# Altium schematic sheet PCIE.SchDoc: PCIE
size A3; Author: Silvio Navaretti; CompanyName: ARDUINO; Organization: ARDUINO; SheetNumber: 24; SheetTotal: 51; RevAuthor: Silvio Navaretti
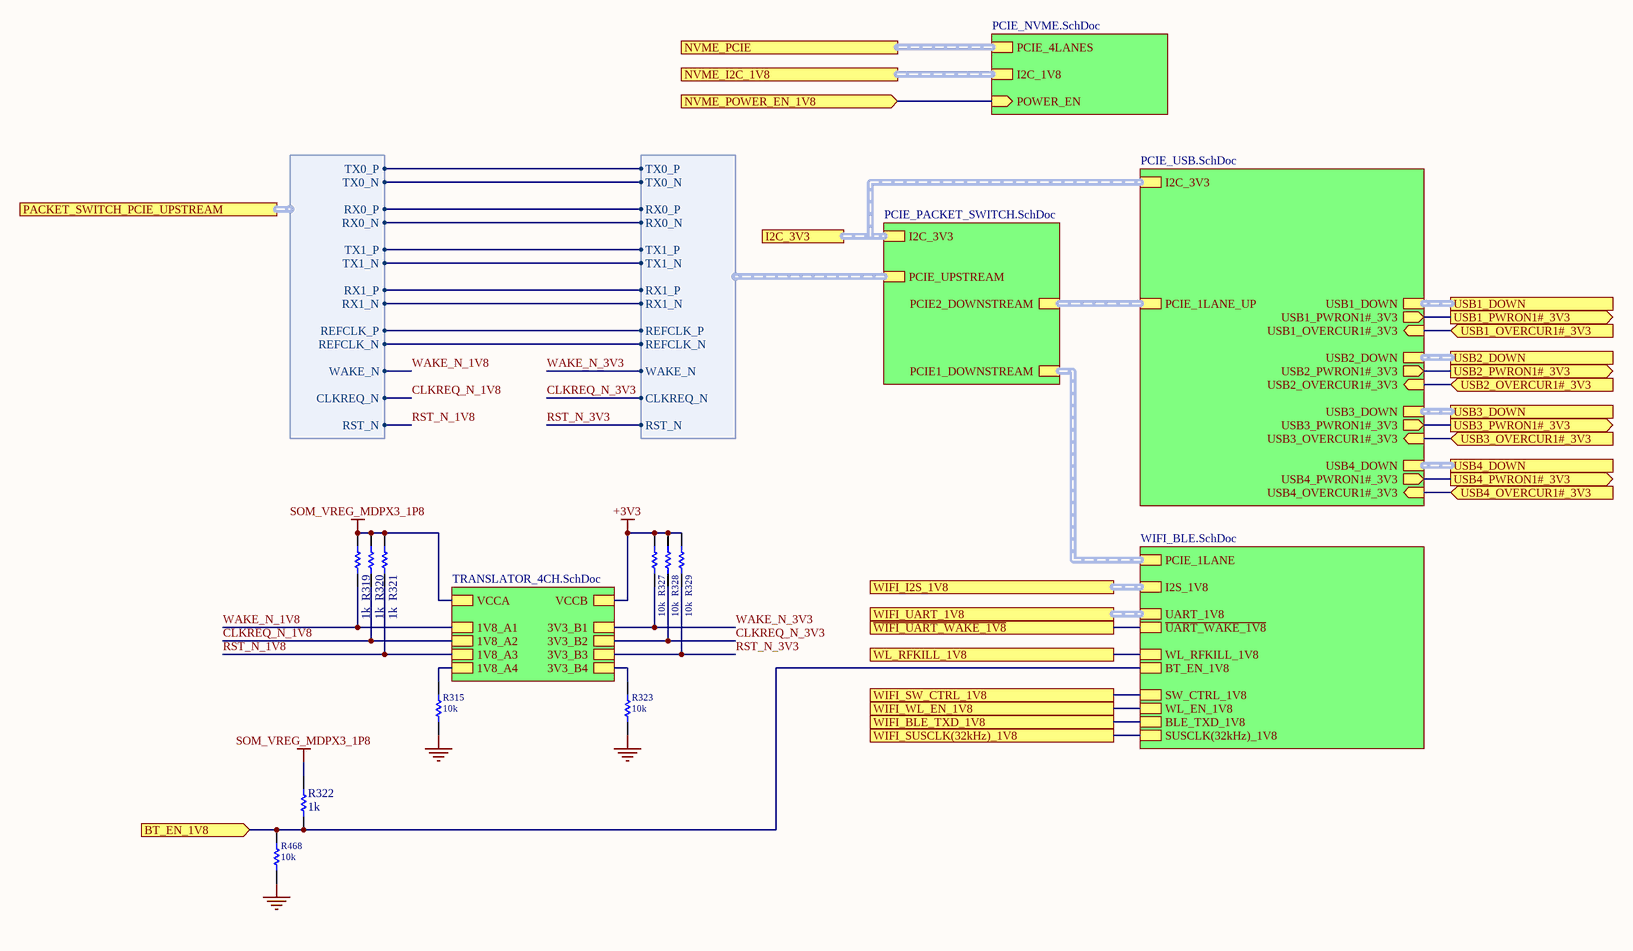
[diagram p0: PCIE.SchDoc]

## Parts
R315  value 10k  [RES-0201]  (hidden comment: RC0201FR-0710KL)
R319  value 1k  [RES-0201]  (hidden comment: RC0201FR-071KL)
R320  value 1k  [RES-0201]  (hidden comment: RC0201FR-071KL)
R321  value 1k  [RES-0201]  (hidden comment: RC0201FR-071KL)
R322  value 1k  [RES-0201]  (hidden comment: RC0201FR-071KL)
R323  value 10k  [RES-0201]  (hidden comment: RC0201FR-0710KL)
R327  value 10k  [RES-0201]  (hidden comment: RC0201FR-0710KL)
R328  value 10k  [RES-0201]  (hidden comment: RC0201FR-0710KL)
R329  value 10k  [RES-0201]  (hidden comment: RC0201FR-0710KL)
R468  value 10k  [RES-0201]  (hidden comment: RC0201FR-0710KL)

## Sub-sheets
U_PCIE_NVME = PCIE_NVME.SchDoc: POWER_EN (in), PCIE_4LANES (harness SOM_MD_PCIE1), I2C_1V8 (harness I2C)
U_PCIE_PACKET_SWITCH = PCIE_PACKET_SWITCH.SchDoc: PCIE_UPSTREAM (harness SOM_MD_PCIE0), I2C_3V3 (harness I2C), PCIE1_DOWNSTREAM (harness PCIE_1LANE), PCIE2_DOWNSTREAM (harness PCIE_1LANE)
U_PCIE_USB = PCIE_USB.SchDoc: USB1_DOWN (harness SOM_MD_USB0), USB1_PWRON1#_3V3 (out), USB1_OVERCUR1#_3V3 (in), USB2_DOWN (harness SOM_MD_USB0), USB2_PWRON1#_3V3 (out), USB2_OVERCUR1#_3V3 (in), USB3_DOWN (harness SOM_MD_USB0), USB3_PWRON1#_3V3 (out), USB3_OVERCUR1#_3V3 (in), USB4_DOWN (harness SOM_MD_USB0), USB4_PWRON1#_3V3 (out), USB4_OVERCUR1#_3V3 (in), PCIE_1LANE_UP (harness PCIE_1LANE), I2C_3V3 (harness I2C)
U_TRANSLATOR_4CH = TRANSLATOR_4CH.SchDoc: 1V8_A1, 1V8_A2, 1V8_A3, 1V8_A4, 3V3_B1, 3V3_B2, 3V3_B3, 3V3_B4, VCCA, VCCB
U_WIFI_BLE = WIFI_BLE.SchDoc: PCIE_1LANE (harness PCIE_1LANE), I2S_1V8 (harness SOM_MD_I2S), WL_RFKILL_1V8, UART_1V8 (harness SOM_MD_UART_FLCRTL), ~{UART_WAKE_1V8}, SW_CTRL_1V8, WL_EN_1V8, BLE_TXD_1V8, SUSCLK(32kHz)_1V8, BT_EN_1V8

## Ports
BT_EN_1V8 (in), I2C_3V3, NVME_I2C_1V8, NVME_PCIE, NVME_POWER_EN_1V8 (in), PACKET_SWITCH_PCIE_UPSTREAM (harness SOM_MD_PCIE0), USB1_DOWN, USB1_OVERCUR1#_3V3 (in), USB1_PWRON1#_3V3 (out), USB2_DOWN, USB2_OVERCUR1#_3V3 (in), USB2_PWRON1#_3V3 (out), USB3_DOWN (harness SOM_MD_USB0), USB3_OVERCUR1#_3V3 (in), USB3_PWRON1#_3V3 (out), USB4_DOWN, USB4_OVERCUR1#_3V3 (in), USB4_PWRON1#_3V3 (out), WIFI_BLE_TXD_1V8, WIFI_I2S_1V8, WIFI_SUSCLK(32kHz)_1V8, WIFI_SW_CTRL_1V8, WIFI_UART_1V8, WIFI_WL_EN_1V8, WL_RFKILL_1V8, ~{WIFI_UART_WAKE_1V8}

## Harnesses
SOM_MD_PCIE0: RX0_N, RX0_P, TX0_P, TX0_N, RX1_N, RX1_P, TX1_P, TX1_N, REFCLK_N, REFCLK_P, WAKE_N, CLKREQ_N, RST_N

## Nets
+3V3: R327.1 R328.1 R329.1 ; sheet U_TRANSLATOR_4CH/VCCB
GND: R315.1 R323.1 R468.1
SOM_VREG_MDPX3_1P8: R319.1 R320.1 R321.1 R322.2 ; sheet U_TRANSLATOR_4CH/VCCA
BT_EN_1V8: R322.1 R468.2 ; port BT_EN_1V8, sheet U_WIFI_BLE/BT_EN_1V8
CLKREQ_N_1V8: R320.2 ; sheet U_TRANSLATOR_4CH/1V8_A2, port PACKET_SWITCH_PCIE_UPSTREAM.CLKREQ_N
CLKREQ_N_3V3: R328.2 ; sheet U_TRANSLATOR_4CH/3V3_B2, sheet U_PCIE_PACKET_SWITCH/PCIE_UPSTREAM.CLKREQ_N
NVME_POWER_EN_1V8: port NVME_POWER_EN_1V8, sheet U_PCIE_NVME/POWER_EN
RST_N_1V8: R321.2 ; sheet U_TRANSLATOR_4CH/1V8_A3, port PACKET_SWITCH_PCIE_UPSTREAM.RST_N
RST_N_3V3: R329.2 ; sheet U_TRANSLATOR_4CH/3V3_B3, sheet U_PCIE_PACKET_SWITCH/PCIE_UPSTREAM.RST_N
USB1_OVERCUR1#_3V3: port USB1_OVERCUR1#_3V3, sheet U_PCIE_USB/USB1_OVERCUR1#_3V3
USB1_PWRON1#_3V3: port USB1_PWRON1#_3V3, sheet U_PCIE_USB/USB1_PWRON1#_3V3
USB2_OVERCUR1#_3V3: port USB2_OVERCUR1#_3V3, sheet U_PCIE_USB/USB2_OVERCUR1#_3V3
USB2_PWRON1#_3V3: port USB2_PWRON1#_3V3, sheet U_PCIE_USB/USB2_PWRON1#_3V3
USB3_OVERCUR1#_3V3: port USB3_OVERCUR1#_3V3, sheet U_PCIE_USB/USB3_OVERCUR1#_3V3
USB3_PWRON1#_3V3: port USB3_PWRON1#_3V3, sheet U_PCIE_USB/USB3_PWRON1#_3V3
USB4_OVERCUR1#_3V3: port USB4_OVERCUR1#_3V3, sheet U_PCIE_USB/USB4_OVERCUR1#_3V3
USB4_PWRON1#_3V3: port USB4_PWRON1#_3V3, sheet U_PCIE_USB/USB4_PWRON1#_3V3
~{WIFI_UART_WAKE_1V8}: port ~{WIFI_UART_WAKE_1V8}, sheet U_WIFI_BLE/~{UART_WAKE_1V8}
WAKE_N_1V8: R319.2 ; sheet U_TRANSLATOR_4CH/1V8_A1, port PACKET_SWITCH_PCIE_UPSTREAM.WAKE_N
WAKE_N_3V3: R327.2 ; sheet U_TRANSLATOR_4CH/3V3_B1, sheet U_PCIE_PACKET_SWITCH/PCIE_UPSTREAM.WAKE_N
WIFI_BLE_TXD_1V8: port WIFI_BLE_TXD_1V8, sheet U_WIFI_BLE/BLE_TXD_1V8
WIFI_SUSCLK(32kHz)_1V8: port WIFI_SUSCLK(32kHz)_1V8, sheet U_WIFI_BLE/SUSCLK(32kHz)_1V8
WIFI_SW_CTRL_1V8: port WIFI_SW_CTRL_1V8, sheet U_WIFI_BLE/SW_CTRL_1V8
WIFI_WL_EN_1V8: port WIFI_WL_EN_1V8, sheet U_WIFI_BLE/WL_EN_1V8
WL_RFKILL_1V8: port WL_RFKILL_1V8, sheet U_WIFI_BLE/WL_RFKILL_1V8
NetR315_2: R315.2 ; sheet U_TRANSLATOR_4CH/1V8_A4
NetR323_2: R323.2 ; sheet U_TRANSLATOR_4CH/3V3_B4
(unnamed): port PACKET_SWITCH_PCIE_UPSTREAM.RX0_N, sheet U_PCIE_PACKET_SWITCH/PCIE_UPSTREAM.RX0_N
(unnamed): port PACKET_SWITCH_PCIE_UPSTREAM.RX0_P, sheet U_PCIE_PACKET_SWITCH/PCIE_UPSTREAM.RX0_P
(unnamed): port PACKET_SWITCH_PCIE_UPSTREAM.TX0_P, sheet U_PCIE_PACKET_SWITCH/PCIE_UPSTREAM.TX0_P
(unnamed): port PACKET_SWITCH_PCIE_UPSTREAM.TX0_N, sheet U_PCIE_PACKET_SWITCH/PCIE_UPSTREAM.TX0_N
(unnamed): port PACKET_SWITCH_PCIE_UPSTREAM.RX1_N, sheet U_PCIE_PACKET_SWITCH/PCIE_UPSTREAM.RX1_N
(unnamed): port PACKET_SWITCH_PCIE_UPSTREAM.RX1_P, sheet U_PCIE_PACKET_SWITCH/PCIE_UPSTREAM.RX1_P
(unnamed): port PACKET_SWITCH_PCIE_UPSTREAM.TX1_P, sheet U_PCIE_PACKET_SWITCH/PCIE_UPSTREAM.TX1_P
(unnamed): port PACKET_SWITCH_PCIE_UPSTREAM.TX1_N, sheet U_PCIE_PACKET_SWITCH/PCIE_UPSTREAM.TX1_N
(unnamed): port PACKET_SWITCH_PCIE_UPSTREAM.REFCLK_N, sheet U_PCIE_PACKET_SWITCH/PCIE_UPSTREAM.REFCLK_N
(unnamed): port PACKET_SWITCH_PCIE_UPSTREAM.REFCLK_P, sheet U_PCIE_PACKET_SWITCH/PCIE_UPSTREAM.REFCLK_P

## Buses and harness runs
harness port I2C_3V3 = sheet U_PCIE_PACKET_SWITCH/I2C_3V3 = sheet U_PCIE_USB/I2C_3V3
harness port NVME_I2C_1V8 = sheet U_PCIE_NVME/I2C_1V8
harness port NVME_PCIE = sheet U_PCIE_NVME/PCIE_4LANES
harness port USB1_DOWN = sheet U_PCIE_USB/USB1_DOWN
harness port USB2_DOWN = sheet U_PCIE_USB/USB2_DOWN
harness port USB3_DOWN = sheet U_PCIE_USB/USB3_DOWN
harness port USB4_DOWN = sheet U_PCIE_USB/USB4_DOWN
harness port WIFI_I2S_1V8 = sheet U_WIFI_BLE/I2S_1V8
harness port WIFI_UART_1V8 = sheet U_WIFI_BLE/UART_1V8
harness sheet U_PCIE_PACKET_SWITCH/PCIE1_DOWNSTREAM = sheet U_WIFI_BLE/PCIE_1LANE
harness sheet U_PCIE_PACKET_SWITCH/PCIE2_DOWNSTREAM = sheet U_PCIE_USB/PCIE_1LANE_UP

## Notes on the sheet
- Title:
- ID:
- Date:
- Time:
- Version:
- Sheet
- of
- RevAuthor:
- Reference Designs ARE PROVIDED "AS IS" AND "WITH ALL FAULTS. Arduino SA DISCLAIMS ALL OTHER WARRANTIES, EXPRESS OR IMPLIED, REGARDING PRODUCTS, INCLUDING BUT NOT LIMITED TO, ANY IMPLIED WARRANTIES OF MERCHANTABILITY OR FITNESS FOR A PARTICULAR PURPOSE.
  Arduino SA may make changes to specifications and product descriptions at any time, without notice. The Customer must not rely on the absence or characteristics of any features or instructions marked "reserved" or "undefined".
  Arduino SA reserves these for future definition and shall have no responsibility whatsoever for conflicts or incompatibilities arising from future changes to them. The product information on the Web Site or Materials is subject to change without notice.
  Do not finalize a design with this info. ARDUINO and other Arduino brands and logos and Trademarks of Arduino SA. All Arduino SA Trademarks cannot be used without owner's formal permission.
- File:
- Author:

## Library data of the parts
R315 R323 R327-R329 R468 = R0145-A.21: RES CHIP 0201 10k 1% 1/20W; Manufacturer: Yageo; Power: 50mW; Temperature coefficient: 200ppm; Code Arduino: R0145; Manufacturer 2: Samsung Electro-Mechanics; Tolerance: 1%; Case Code (Imperial): 0201; Part Number: RC0201FR-0710KL; Technology: Thick film
R319-R322 = R0195-A.22: RES CHIP 0201 1k 1% 1/20W; Manufacturer: Yageo; Power: 50mW; Temperature coefficient: 200ppm; Code Arduino: R0195; Tolerance: 1%; Case Code (Imperial): 0201; Part Number: RC0201FR-071KL; Technology: Thick film